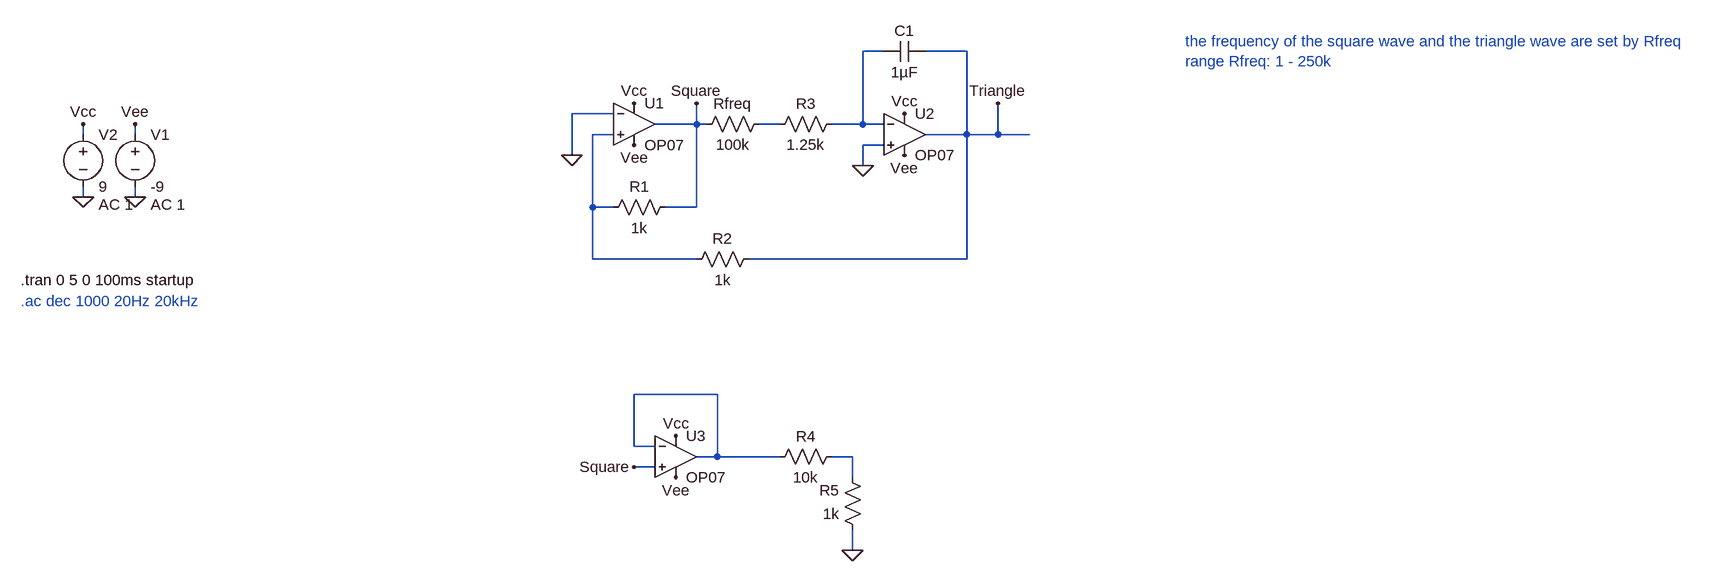
[diagram p0: schematic ChorusLFO draft.asc]
ChorusLFO draft.asc, the LTspice schematic file:
Version 4
SHEET 1 2476 740
WIRE 1168 -48 1136 -48
WIRE 1296 -48 1232 -48
WIRE 752 48 688 48
WIRE 880 64 880 32
WIRE 880 64 816 64
WIRE 896 64 880 64
WIRE 1008 64 976 64
WIRE 1136 64 1136 -48
WIRE 1136 64 1088 64
WIRE 1168 64 1136 64
WIRE -64 80 -64 64
WIRE 16 80 16 64
WIRE 752 80 720 80
WIRE 1296 80 1296 -48
WIRE 1296 80 1232 80
WIRE 1344 80 1344 32
WIRE 1344 80 1296 80
WIRE 1392 80 1344 80
WIRE 1168 96 1136 96
WIRE 688 112 688 48
WIRE 1136 128 1136 96
WIRE -64 176 -64 160
WIRE 16 176 16 160
WIRE 720 192 720 80
WIRE 752 192 720 192
WIRE 880 192 880 64
WIRE 880 192 832 192
WIRE 720 272 720 192
WIRE 880 272 720 272
WIRE 1296 272 1296 80
WIRE 1296 272 960 272
WIRE 912 480 784 480
WIRE 784 560 784 480
WIRE 816 560 784 560
WIRE 912 576 912 480
WIRE 912 576 880 576
WIRE 1008 576 912 576
WIRE 1120 576 1088 576
WIRE 816 592 784 592
WIRE 1120 608 1120 576
WIRE 1120 720 1120 688
FLAG -64 64 Vcc
FLAG 16 64 Vee
FLAG 16 176 0
FLAG -64 176 0
FLAG 784 32 Vcc
FLAG 1200 48 Vcc
FLAG 784 96 Vee
FLAG 1200 112 Vee
FLAG 1136 128 0
FLAG 688 112 0
FLAG 880 32 Square
FLAG 1344 32 Triangle
FLAG 848 544 Vcc
FLAG 848 608 Vee
FLAG 784 592 Square
FLAG 1120 720 0
SYMBOL voltage 16 64 R0
WINDOW 123 24 124 Left 2
WINDOW 39 0 0 Left 0
SYMATTR Value2 AC 1
SYMATTR InstName V1
SYMATTR Value -9
SYMBOL voltage -64 64 R0
WINDOW 123 24 124 Left 2
WINDOW 39 0 0 Left 0
SYMATTR Value2 AC 1
SYMATTR InstName V2
SYMATTR Value 9
SYMBOL OpAmps\\OP07 784 0 R0
SYMATTR InstName U1
SYMBOL OpAmps\\OP07 1200 16 R0
SYMATTR InstName U2
SYMBOL res 992 48 R90
WINDOW 0 0 56 VBottom 2
WINDOW 3 32 56 VTop 2
SYMATTR InstName Rfreq
SYMATTR Value 100k
SYMBOL res 848 176 R90
WINDOW 0 0 56 VBottom 2
WINDOW 3 32 56 VTop 2
SYMATTR InstName R1
SYMATTR Value 1k
SYMBOL res 976 256 R90
WINDOW 0 0 56 VBottom 2
WINDOW 3 32 56 VTop 2
SYMATTR InstName R2
SYMATTR Value 1k
SYMBOL cap 1232 -64 R90
WINDOW 0 0 32 VBottom 2
WINDOW 3 32 32 VTop 2
SYMATTR InstName C1
SYMATTR Value 1µF
SYMBOL res 1104 48 R90
WINDOW 0 0 56 VBottom 2
WINDOW 3 32 56 VTop 2
SYMATTR InstName R3
SYMATTR Value 1.25k
SYMBOL OpAmps\\OP07 848 512 R0
SYMATTR InstName U3
SYMBOL res 1104 560 R90
WINDOW 0 0 56 VBottom 2
WINDOW 3 32 56 VTop 2
SYMATTR InstName R4
SYMATTR Value 10k
SYMBOL res 1136 704 R180
WINDOW 0 36 76 Left 2
WINDOW 3 36 40 Left 2
SYMATTR InstName R5
SYMATTR Value 1k
TEXT -160 304 Left 2 !.tran 0 5 0 100ms startup
TEXT 1632 -64 Left 2 ;the frequency of the square wave and the triangle wave are set by Rfreq\nrange Rfreq: 1 - 250k
TEXT -160 336 Left 2 ;.ac dec 1000 20Hz 20kHz

The netlist it stands for:
* ChorusLFO draft.asc
V1 Vee 0 -9 AC 1
V2 Vcc 0 9 AC 1
XU1 N003 0 Vcc Vee Square LT1001  ; OP07, pins In+ In- V+ V- OUT
XU2 0 N001 Vcc Vee Triangle LT1001  ; OP07, pins In+ In- V+ V- OUT
Rfreq N002 Square 100k
R1 Square N003 1k
R2 Triangle N003 1k
C1 Triangle N001 1µF
R3 N001 N002 1.25k
XU3 Square N004 Vcc Vee N004 LT1001  ; OP07, pins In+ In- V+ V- OUT
R4 N005 N004 10k
R5 0 N005 1k
.tran 0 5 0 100ms startup
* the frequency of the square wave and the triangle wave are set by Rfreq
* range Rfreq: 1 - 250k
* .ac dec 1000 20Hz 20kHz
.lib LTC.lib
.backanno
.end